# EAGLE design RPi_SPI_outputs_uln_v02 (EAGLE 7.2.0)
AUTHOR: M.Petrilak; VERSION: 01
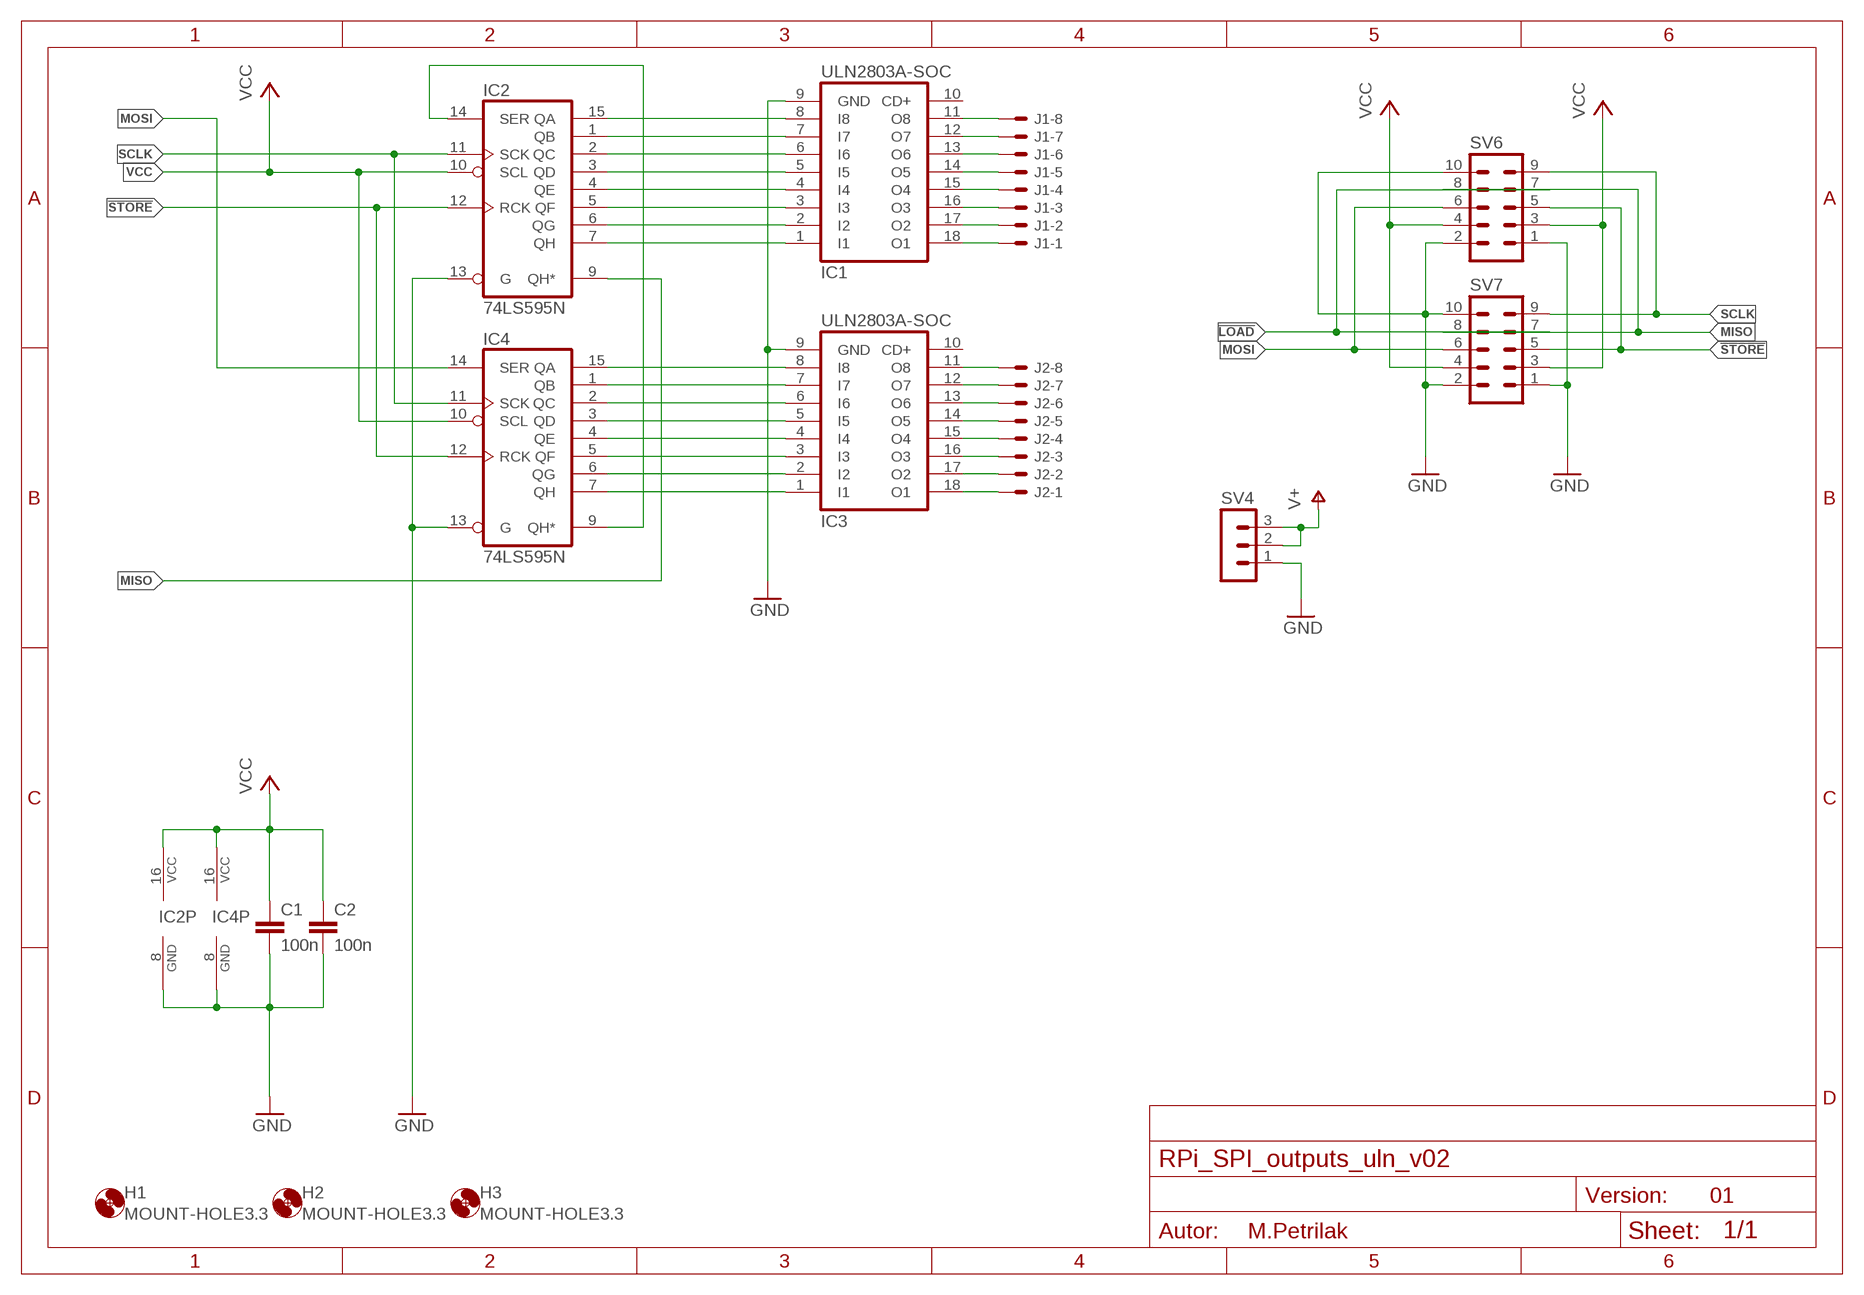
[diagram p0: schematic, sheet 1]

## Parts
C1  100n  C-EUC1206  [C1206]
C2  100n  C-EUC1206  [C1206]
H1  MOUNT-HOLE3.3  [3,3]
H2  MOUNT-HOLE3.3  [3,3]
H3  MOUNT-HOLE3.3  [3,3]
IC1  ULN2803A-SOC  [SOCKET-18]
IC2  74LS595N  [DIL16]
IC3  ULN2803A-SOC  [SOCKET-18]
IC4  74LS595N  [DIL16]
J1  22-05-7088-SPEC-08  [7395-08_SPEC]
J2  22-05-7088-SPEC-08  [7395-08_SPEC]
SV4  MA03-1_NO  [MA03-1_NO]
SV6  ML10  [ML10]
SV7  ML10  [ML10]

## Nets
!LOAD: SV6.7 SV7.7
!STORE: IC2.12(RCK) IC4.12(RCK) SV6.5 SV7.5
GND: C1.2 C2.2 IC1.9(GND) IC2.8(GND) IC2.13(G) IC3.9(GND) IC4.8(GND) IC4.13(G) SV4.1 SV6.1 SV6.2 SV6.10 SV7.1 SV7.2 SV7.10
MISO: IC2.9(QH*) SV6.8 SV7.8
MOSI: IC4.14(SER) SV6.6 SV7.6
N$1: IC1.8(I8) IC2.15(QA)
N$2: IC1.7(I7) IC2.1(QB)
N$3: IC1.6(I6) IC2.2(QC)
N$4: IC1.5(I5) IC2.3(QD)
N$5: IC1.4(I4) IC2.4(QE)
N$6: IC1.3(I3) IC2.5(QF)
N$7: IC1.2(I2) IC2.6(QG)
N$8: IC1.1(I1) IC2.7(QH)
N$9: IC3.8(I8) IC4.15(QA)
N$10: IC3.7(I7) IC4.1(QB)
N$11: IC3.6(I6) IC4.2(QC)
N$12: IC3.5(I5) IC4.3(QD)
N$13: IC3.4(I4) IC4.4(QE)
N$14: IC3.3(I3) IC4.5(QF)
N$15: IC3.2(I2) IC4.6(QG)
N$16: IC3.1(I1) IC4.7(QH)
N$17: IC2.14(SER) IC4.9(QH*)
N$18: IC1.18(O1) J1.1
N$19: IC1.17(O2) J1.2
N$20: IC1.16(O3) J1.3
N$21: IC1.15(O4) J1.4
N$22: IC1.14(O5) J1.5
N$23: IC1.13(O6) J1.6
N$24: IC1.12(O7) J1.7
N$25: IC1.11(O8) J1.8
N$26: IC3.18(O1) J2.1
N$27: IC3.17(O2) J2.2
N$28: IC3.16(O3) J2.3
N$29: IC3.15(O4) J2.4
N$30: IC3.14(O5) J2.5
N$31: IC3.13(O6) J2.6
N$32: IC3.12(O7) J2.7
N$33: IC3.11(O8) J2.8
SCLK: IC2.11(SCK) IC4.11(SCK) SV6.9 SV7.9
V+: SV4.2 SV4.3
VCC: C1.1 C2.1 IC2.10(SCL) IC2.16(VCC) IC4.10(SCL) IC4.16(VCC) SV6.3 SV6.4 SV7.3 SV7.4
Unconnected: IC1.10(CD+) IC3.10(CD+)

## Library data of the parts
C1 C2 = rcl:C-EU: CAPACITOR, European symbol
H1-H3 = holes:MOUNT-HOLE: MOUNTING HOLE with drill center marker
IC1 IC3 = uln-udn:ULN2803A: DRIVER ARRAY
IC2 IC4 = 74xx-us:74*595: 8-bit SHIFT REGISTER, output latch
J1 J2 = con-molex:22-?-08: CONNECTOR wire to board 2.54 mm (.1 inch) pitch header
SV4 = con-lstb:MA03-1: PIN HEADER
SV6 SV7 = con-harting-ml:ML10: HARTING

## Board
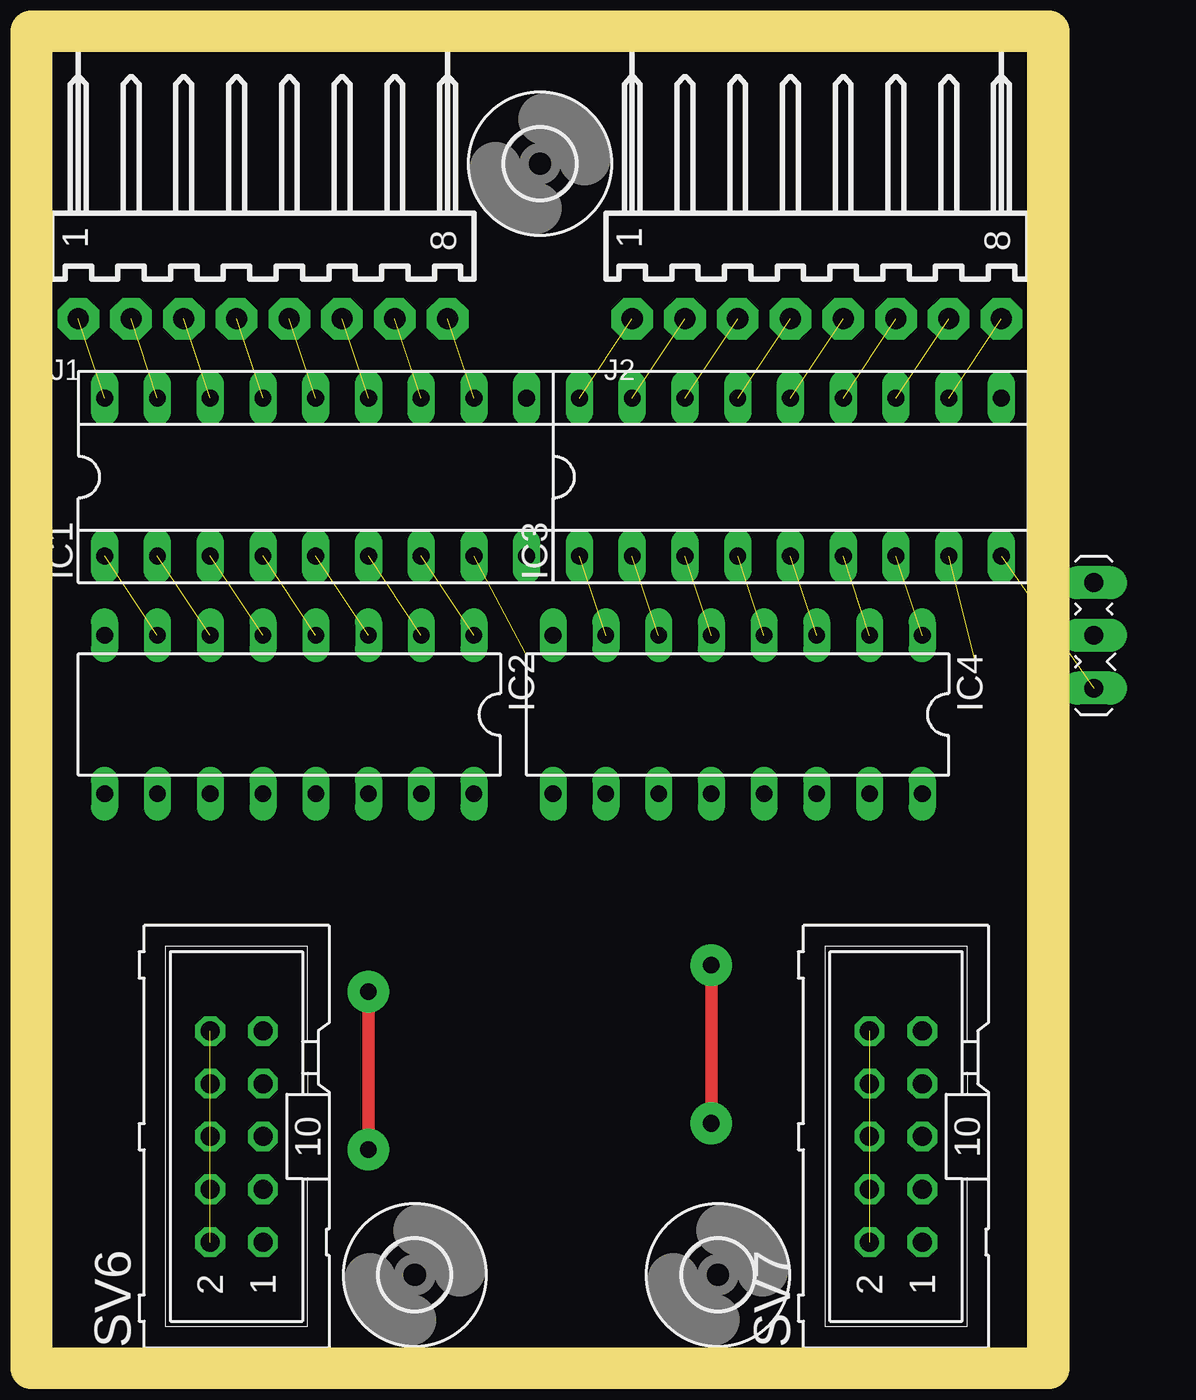
[diagram p1: board, top side]
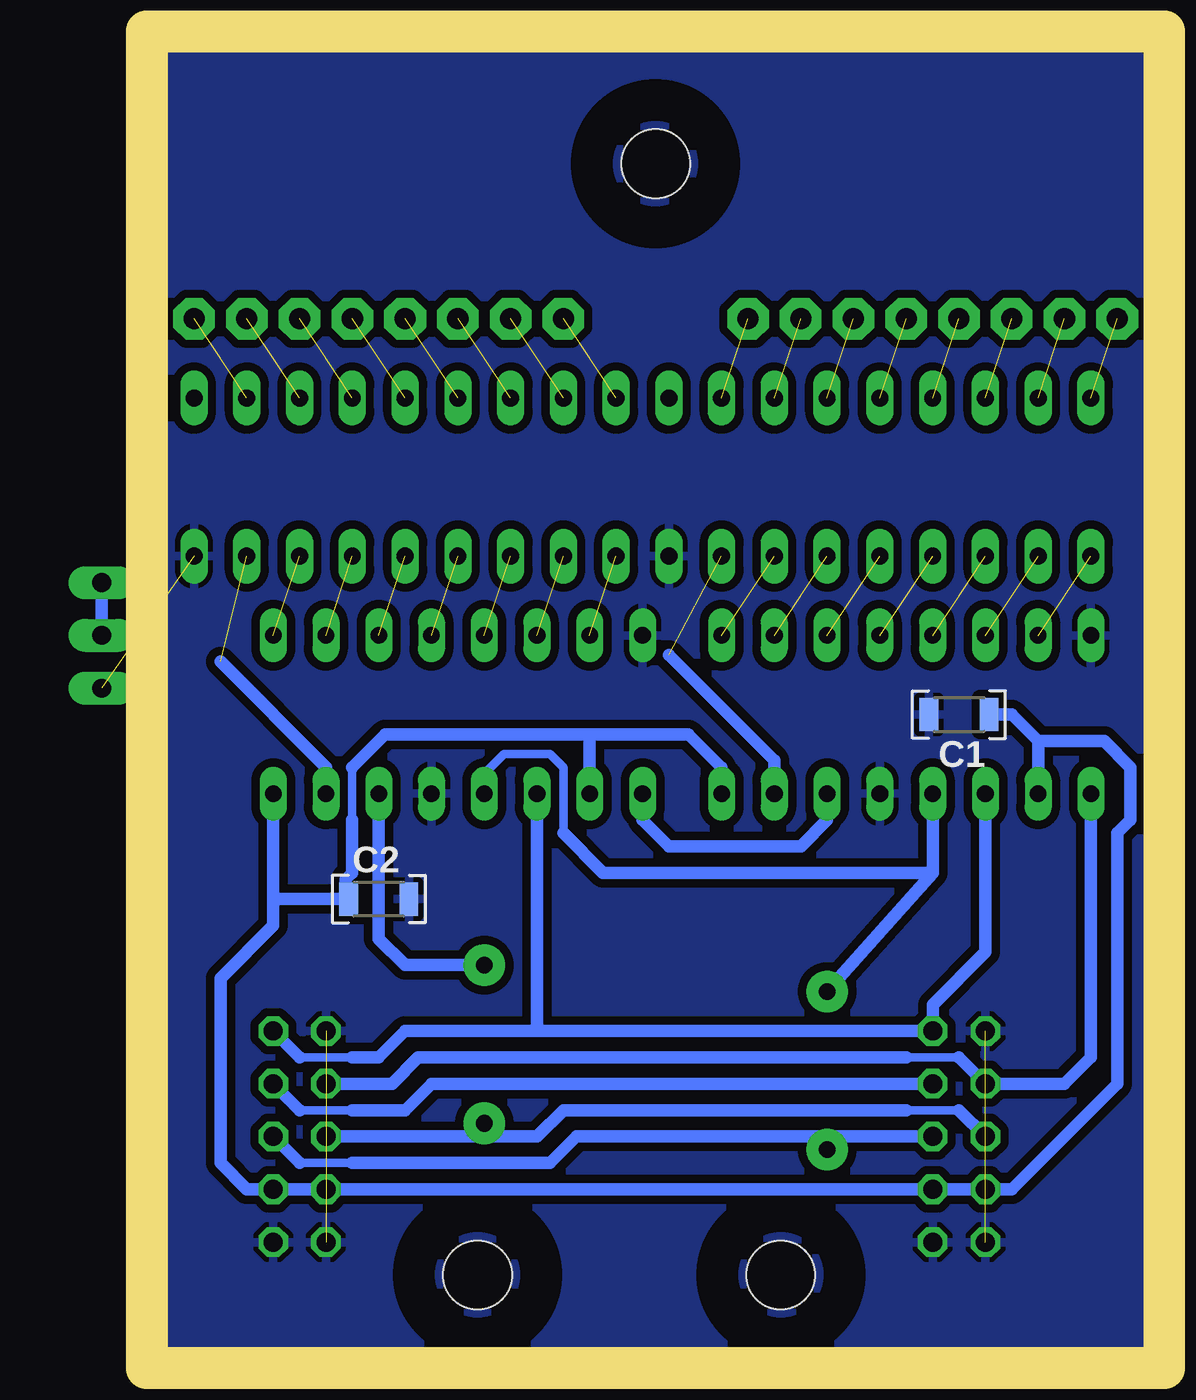
[diagram p2: board, bottom side, seen from below]

Size 47 x 62.38 mm. Coordinates in mm from the lower left corner, seen from the top.
Outline: 0,0 47,0 47,62.38 0,62.38 0,0
Copper layers (1*16): Top 0.035mm / dielectric 1.5mm / Bottom 0.035mm
Design rules "Michal_CNC_doma *": minimum track width 0.3mm, minimum drill 0.6mm, track to track 0.4mm, track to pad 0.4mm, pad to pad 0.4mm, via to via 0.4mm, smd to smd 8mil, copper to edge 1mil, drill to drill 8mil, minimum pad ring 10mil, minimum via ring 8mil, stop-mask expansion 4mil, vias tented up to drill 0mil, thermal gap 10mil
Milling: 4 lines

### Footprints (pad centres in the part's own frame; a part is rotated, then mirrored left to right if it is on the bottom)
C1206 = smd 0.9 x 1.6: 1 -1.45,0; 2 1.45,0
3,3 = hole 3.3: 0,0
SOCKET-18 = drill 0.813 long: 1 -10.16,-3.81; 2 -7.62,-3.81; 3 -5.08,-3.81; 4 -2.54,-3.81; 5 0,-3.81; 6 2.54,-3.81; 7 5.08,-3.81; 8 7.62,-3.81; 9 10.16,-3.81; 10 10.16,3.81; 11 7.62,3.81; 12 5.08,3.81; 13 2.54,3.81; 14 0,3.81; 15 -2.54,3.81; 16 -5.08,3.81; 17 -7.62,3.81; 18 -10.16,3.81
DIL16 = drill 0.8 long: 1 -8.89,-3.81; 2 -6.35,-3.81; 3 -3.81,-3.81; 4 -1.27,-3.81; 5 1.27,-3.81; 6 3.81,-3.81; 7 6.35,-3.81; 8 8.89,-3.81; 9 8.89,3.81; 10 6.35,3.81; 11 3.81,3.81; 12 1.27,3.81; 13 -1.27,3.81; 14 -3.81,3.81; 15 -6.35,3.81; 16 -8.89,3.81
7395-08_SPEC = drill 1.016 pad 2 octagon: 1 8.89,0; 2 6.35,0; 3 3.81,0; 4 1.27,0; 5 -1.27,0; 6 -3.81,0; 7 -6.35,0; 8 -8.89,0
MA03-1_NO = drill 0.9 pad 1.6 long: 1 -2.54,0; 2 0,0; 3 2.54,0
ML10 = drill 0.914 octagon: 1 -5.08,-1.27; 2 -5.08,1.27; 3 -2.54,-1.27; 4 -2.54,1.27; 5 0,-1.27; 6 0,1.27; 7 2.54,-1.27; 8 2.54,1.27; 9 5.08,-1.27; 10 5.08,1.27

### Placement (x,y rotation side)
C1  8.89,30.48 180 bottom
C2  36.83,21.59 0 bottom
H1  17.47,3.5 0 top
H2  32.07,3.5 0 top
H3  23.5,57 0 top
IC1  12.7,41.91 0 top
IC2  11.43,30.48 180 top
IC3  35.56,41.91 0 top
IC4  33.02,30.48 180 top
J1  10.16,49.53 180 top
J2  36.83,49.53 180 top
SV4  50.16,34.29 90 top  (outside the outline)
SV6  8.89,10.16 90 top
SV7  40.64,10.16 90 top

### Tracks (layer width: path | path; a pad name or v marks a point on that pad's centre or on a via)
!LOAD
  Bottom 0.406: 40.64,11.43 38.1,11.43
  Bottom 0.61: SV7.7 40.64,11.43 | SV6.7 34.29,12.7 35.56,11.43 38.1,11.43
!STORE  (via drill 0.8 pad 2)
  Top 0.61: v15.24,17.14 v15.24,9.53
  Bottom 0.406: IC4.12 31.75,27.62 30.8,28.57 28.57,28.57 27.94,27.94 27.94,24.77 | 40.64,8.89 38.1,8.89
  Bottom 0.61: 10.16,22.86 IC2.12 | SV7.5 40.64,8.89 | 15.24,10.16 27.3,10.16 28.57,8.89 38.1,8.89 | 15.24,10.16 SV6.5 | 10.16,22.86 v15.24,17.14 | v15.24,9.53 15.24,10.16 | 10.16,22.86 26.04,22.86 27.94,24.77
GND  (3 unrouted)
  pour Bottom: 0,0 47,0 47,62.38 0,62.38
MISO
  Bottom 0.406: 8.89,13.97 11.43,13.97
  Bottom 0.61: SV7.8 36.2,12.7 34.92,13.97 11.43,13.97 | 8.89,13.97 SV6.8 3.81,12.7 2.54,13.97 IC2.9
MOSI  (via drill 0.8 pad 2)
  Top 0.61: v31.75,18.41 v31.75,10.79
  Bottom 0.406: 8.89,11.43 11.43,11.43
  Bottom 0.61: SV7.6 31.75,10.16 | 31.75,10.16 29.21,10.16 27.94,11.43 11.43,11.43 | 8.89,11.43 SV6.6 | IC4.14 36.83,19.68 35.56,18.41 v31.75,18.41 | v31.75,10.79 31.75,10.16
N$1  (1 unrouted)
  Bottom 0.61: IC2.15 17.78,28.26 22.86,33.34
N$2  (1 unrouted)
N$3  (1 unrouted)
N$4  (1 unrouted)
N$5  (1 unrouted)
N$6  (1 unrouted)
N$7  (1 unrouted)
N$8  (1 unrouted)
N$9  (1 unrouted)
  Bottom 0.61: IC4.15 39.37,27.94 44.45,33.02
N$10  (1 unrouted)
N$11  (1 unrouted)
N$12  (1 unrouted)
N$13  (1 unrouted)
N$14  (1 unrouted)
N$15  (1 unrouted)
N$16  (1 unrouted)
N$17
  Bottom 0.61: IC2.14 15.24,25.4 16.51,24.13 22.86,24.13 24.13,25.4 IC4.9
N$18  (1 unrouted)
N$19  (1 unrouted)
N$20  (1 unrouted)
N$21  (1 unrouted)
N$22  (1 unrouted)
N$23  (1 unrouted)
N$24  (1 unrouted)
N$25  (1 unrouted)
N$26  (1 unrouted)
N$27  (1 unrouted)
N$28  (1 unrouted)
N$29  (1 unrouted)
N$30  (1 unrouted)
N$31  (1 unrouted)
N$32  (1 unrouted)
N$33  (1 unrouted)
SCLK
  Bottom 0.406: 40.64,13.97 38.1,13.97
  Bottom 0.61: 29.21,15.24 IC4.11 | SV7.9 40.64,13.97 | 29.21,15.24 35.56,15.24 36.83,13.97 38.1,13.97 | 29.21,15.24 SV6.9 10.16,16.51 7.62,19.05 IC2.11
V+
  Bottom 0.61: 48.26,34.29 SV4.2 SV4.3
VCC
  Bottom 0.406: 38.1,25.4 38.1,27.94
  Bottom 0.61: 26.67,29.53 36.51,29.53 38.1,27.94 | 26.67,29.53 21.91,29.53 20.32,27.94 IC2.16 | IC4.10 26.67,29.53 | IC2.10 5.08,29.21 | 5.08,29.21 6.35,30.48 C1.1 | 5.08,29.21 1.91,29.21 0.64,27.94 0.64,25.4 1.27,24.77 1.27,12.7 6.35,7.62 SV6.4 SV6.3 SV7.4 SV7.3 43.18,7.62 44.45,8.89 44.45,17.78 41.91,20.32 41.91,21.59 | 41.91,21.59 C2.1 38.42,21.73 38.42,22.54 38.1,22.86 38.1,25.4 | IC4.16 41.91,21.59